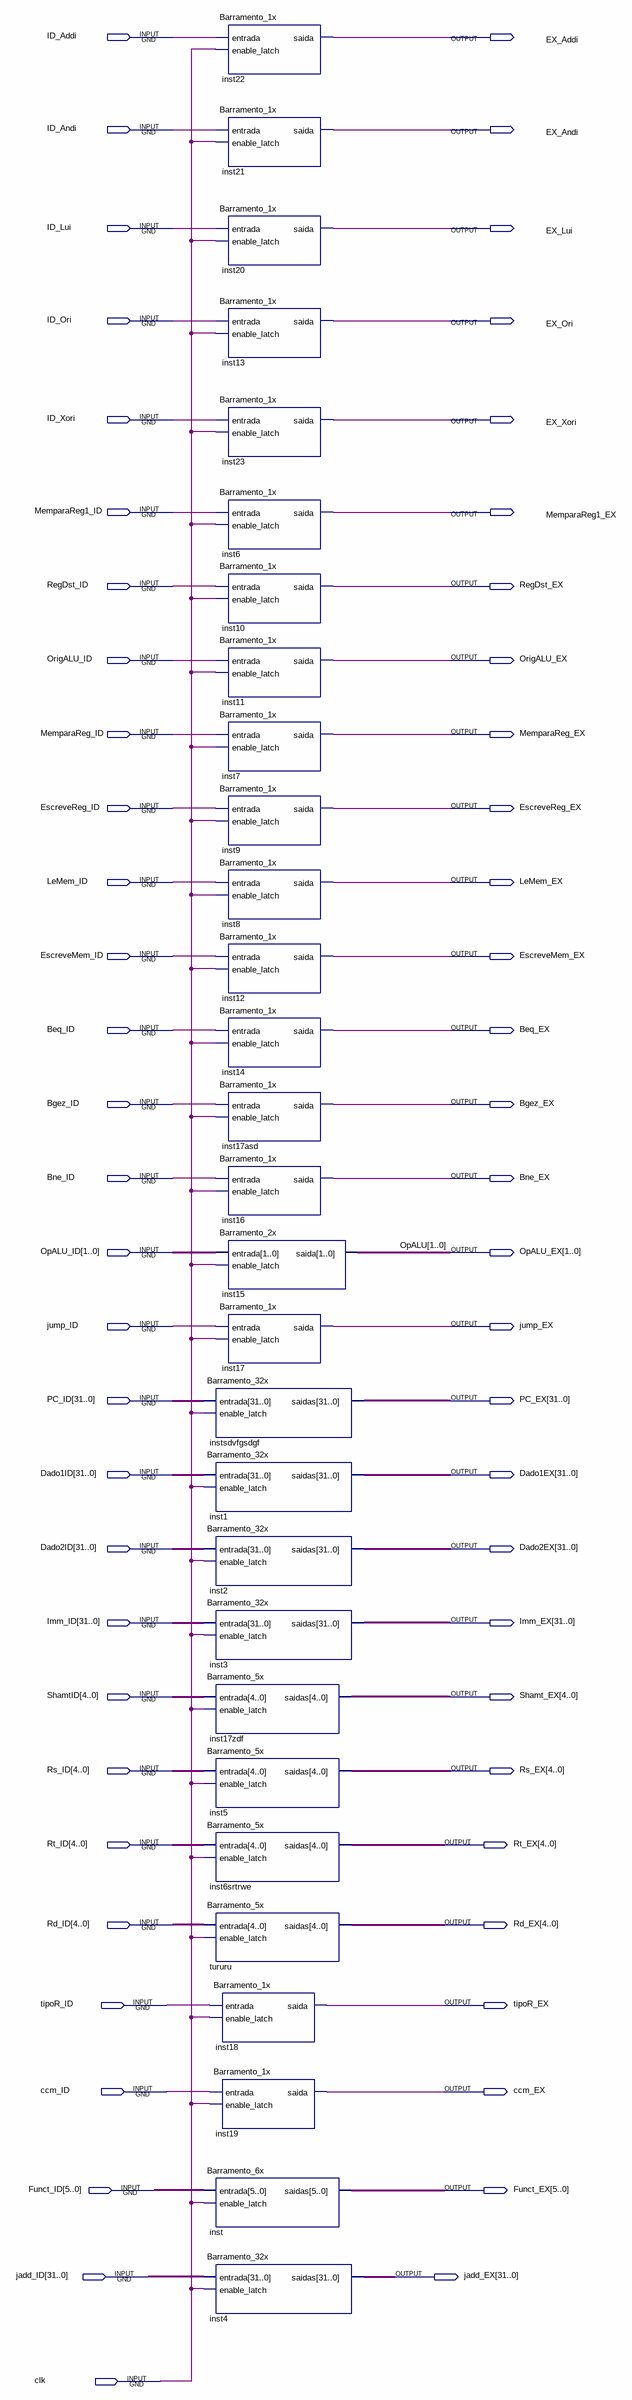
[diagram p0: schematic sheet]
// Quartus schematic ID_EX.bdf as structural Verilog: 29 symbols, 59 pins
module ID_EX (
  input  ID_Addi,
  input  ID_Andi,
  input  ID_Lui,
  input  ID_Ori,
  input  ID_Xori,
  input  MemparaReg1_ID,
  input  RegDst_ID,
  input  OrigALU_ID,
  input  MemparaReg_ID,
  input  EscreveReg_ID,
  input  LeMem_ID,
  input  EscreveMem_ID,
  input  Beq_ID,
  input  Bgez_ID,
  input  Bne_ID,
  input  [1:0] OpALU_ID,
  input  jump_ID,
  input  [31:0] PC_ID,
  input  [31:0] Dado1ID,
  input  [31:0] Dado2ID,
  input  [31:0] Imm_ID,
  input  [4:0] ShamtID,
  input  [4:0] Rs_ID,
  input  [4:0] Rt_ID,
  input  [4:0] Rd_ID,
  input  tipoR_ID,
  input  ccm_ID,
  input  [5:0] Funct_ID,
  input  [31:0] jadd_ID,
  input  clk,
  output EX_Addi,
  output EX_Andi,
  output EX_Lui,
  output EX_Ori,
  output EX_Xori,
  output MemparaReg1_EX,
  output RegDst_EX,
  output OrigALU_EX,
  output MemparaReg_EX,
  output EscreveReg_EX,
  output LeMem_EX,
  output EscreveMem_EX,
  output Beq_EX,
  output Bgez_EX,
  output Bne_EX,
  output [1:0] OpALU_EX,
  output jump_EX,
  output [31:0] PC_EX,
  output [31:0] Dado1EX,
  output [31:0] Dado2EX,
  output [31:0] Imm_EX,
  output [4:0] Shamt_EX,
  output [4:0] Rs_EX,
  output [4:0] Rt_EX,
  output [4:0] Rd_EX,
  output tipoR_EX,
  output ccm_EX,
  output [5:0] Funct_EX,
  output [31:0] jadd_EX
);

  Barramento_1x inst22 (.entrada(ID_Addi), .enable_latch(clk), .saida(EX_Addi));
  Barramento_1x inst21 (.entrada(ID_Andi), .enable_latch(clk), .saida(EX_Andi));
  Barramento_1x inst20 (.entrada(ID_Lui), .enable_latch(clk), .saida(EX_Lui));
  Barramento_1x inst13 (.entrada(ID_Ori), .enable_latch(clk), .saida(EX_Ori));
  Barramento_1x inst23 (.entrada(ID_Xori), .enable_latch(clk), .saida(EX_Xori));
  Barramento_1x inst6 (.entrada(MemparaReg1_ID), .enable_latch(clk), .saida(MemparaReg1_EX));
  Barramento_1x inst10 (.entrada(RegDst_ID), .enable_latch(clk), .saida(RegDst_EX));
  Barramento_1x inst11 (.entrada(OrigALU_ID), .enable_latch(clk), .saida(OrigALU_EX));
  Barramento_1x inst7 (.entrada(MemparaReg_ID), .enable_latch(clk), .saida(MemparaReg_EX));
  Barramento_1x inst9 (.entrada(EscreveReg_ID), .enable_latch(clk), .saida(EscreveReg_EX));
  Barramento_1x inst8 (.entrada(LeMem_ID), .enable_latch(clk), .saida(LeMem_EX));
  Barramento_1x inst12 (.entrada(EscreveMem_ID), .enable_latch(clk), .saida(EscreveMem_EX));
  Barramento_1x inst14 (.entrada(Beq_ID), .enable_latch(clk), .saida(Beq_EX));
  Barramento_1x inst17asd (.entrada(Bgez_ID), .enable_latch(clk), .saida(Bgez_EX));
  Barramento_1x inst16 (.entrada(Bne_ID), .enable_latch(clk), .saida(Bne_EX));
  Barramento_2x inst15 (.entrada(OpALU_ID), .enable_latch(clk), .saida(OpALU_EX));
  Barramento_1x inst17 (.entrada(jump_ID), .enable_latch(clk), .saida(jump_EX));
  Barramento_32x instsdvfgsdgf (.entrada(PC_ID), .enable_latch(clk), .saidas(PC_EX));
  Barramento_32x inst1 (.entrada(Dado1ID), .enable_latch(clk), .saidas(Dado1EX));
  Barramento_32x inst2 (.entrada(Dado2ID), .enable_latch(clk), .saidas(Dado2EX));
  Barramento_32x inst3 (.entrada(Imm_ID), .enable_latch(clk), .saidas(Imm_EX));
  Barramento_5x inst17zdf (.entrada(ShamtID), .enable_latch(clk), .saidas(Shamt_EX));
  Barramento_5x inst5 (.entrada(Rs_ID), .enable_latch(clk), .saidas(Rs_EX));
  Barramento_5x inst6srtrwe (.entrada(Rt_ID), .enable_latch(clk), .saidas(Rt_EX));
  Barramento_5x tururu (.entrada(Rd_ID), .enable_latch(clk), .saidas(Rd_EX));
  Barramento_1x inst18 (.entrada(tipoR_ID), .enable_latch(clk), .saida(tipoR_EX));
  Barramento_1x inst19 (.entrada(ccm_ID), .enable_latch(clk), .saida(ccm_EX));
  Barramento_6x inst (.entrada(Funct_ID), .enable_latch(clk), .saidas(Funct_EX));
  Barramento_32x inst4 (.entrada(jadd_ID), .enable_latch(clk), .saidas(jadd_EX));

  // Other names for the same wires on the sheet: OpALU[1:0] = OpALU_EX
endmodule
